# EAGLE design decoder (EAGLE 9.6.2)
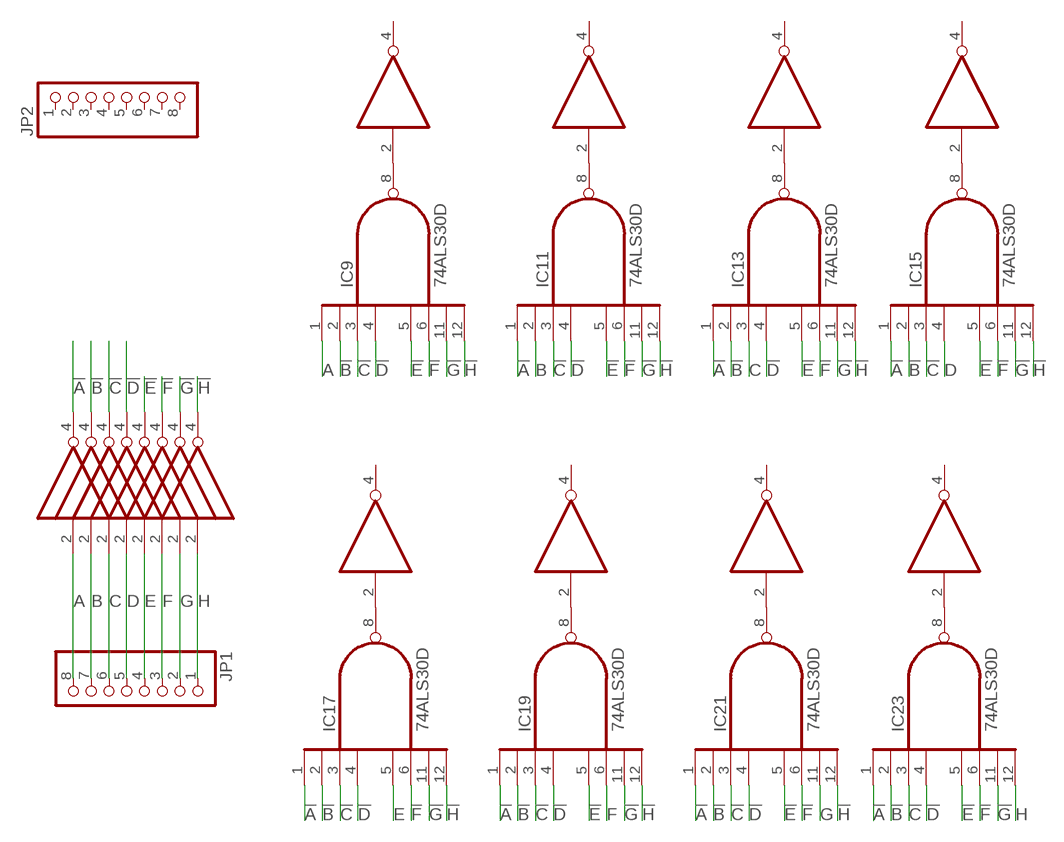
[diagram p0: schematic, sheet 1]

## Parts
IC1  74AUC1G04DBV  [SOT23-5]
IC2  74AUC1G04DBV  [SOT23-5]
IC3  74AUC1G04DBV  [SOT23-5]
IC4  74AUC1G04DBV  [SOT23-5]
IC5  74AUC1G04DBV  [SOT23-5]
IC6  74AUC1G04DBV  [SOT23-5]
IC7  74AUC1G04DBV  [SOT23-5]
IC8  74AUC1G04DBV  [SOT23-5]
IC9  74ALS30D  [SO14]
IC10  74AUC1G04DBV  [SOT23-5]
IC11  74ALS30D  [SO14]
IC12  74AUC1G04DBV  [SOT23-5]
IC13  74ALS30D  [SO14]
IC14  74AUC1G04DBV  [SOT23-5]
IC15  74ALS30D  [SO14]
IC16  74AUC1G04DBV  [SOT23-5]
IC17  74ALS30D  [SO14]
IC18  74AUC1G04DBV  [SOT23-5]
IC19  74ALS30D  [SO14]
IC20  74AUC1G04DBV  [SOT23-5]
IC21  74ALS30D  [SO14]
IC22  74AUC1G04DBV  [SOT23-5]
IC23  74ALS30D  [SO14]
IC24  74AUC1G04DBV  [SOT23-5]
JP1  PINHD-1X8  [1X08]
JP2  PINHD-1X8  [1X08]

## Nets
!A: IC1.4(O) IC11.1(I0) IC13.1(I0) IC15.1(I0) IC17.1(I0) IC19.1(I0) IC21.1(I0) IC23.1(I0)
!B: IC2.4(O) IC9.2(I1) IC13.2(I1) IC15.2(I1) IC17.2(I1) IC19.2(I1) IC21.2(I1) IC23.2(I1)
!C: IC3.4(O) IC9.3(I2) IC11.3(I2) IC15.3(I2) IC17.3(I2) IC19.3(I2) IC21.3(I2) IC23.3(I2)
!D: IC4.4(O) IC9.4(I3) IC11.4(I3) IC13.4(I3) IC17.4(I3) IC19.4(I3) IC21.4(I3) IC23.4(I3)
!E: IC5.4(O) IC9.5(I4) IC11.5(I4) IC13.5(I4) IC15.5(I4) IC19.5(I4) IC21.5(I4) IC23.5(I4)
!F: IC6.4(O) IC9.6(I5) IC11.6(I5) IC13.6(I5) IC15.6(I5) IC17.6(I5) IC21.6(I5) IC23.6(I5)
!G: IC7.4(O) IC9.11(I6) IC11.11(I6) IC13.11(I6) IC15.11(I6) IC17.11(I6) IC19.11(I6) IC23.11(I6)
!H: IC8.4(O) IC9.12(I7) IC11.12(I7) IC13.12(I7) IC15.12(I7) IC17.12(I7) IC19.12(I7) IC21.12(I7)
A: IC1.2(I) IC9.1(I0) JP1.8
B: IC2.2(I) IC11.2(I1) JP1.7
C: IC3.2(I) IC13.3(I2) JP1.6
D: IC4.2(I) IC15.4(I3) JP1.5
E: IC5.2(I) IC17.5(I4) JP1.4
F: IC6.2(I) IC19.6(I5) JP1.3
G: IC7.2(I) IC21.11(I6) JP1.2
H: IC8.2(I) IC23.12(I7) JP1.1
N$1: IC9.8(O) IC10.2(I)
N$2: IC11.8(O) IC12.2(I)
N$3: IC13.8(O) IC14.2(I)
N$4: IC15.8(O) IC16.2(I)
N$5: IC17.8(O) IC18.2(I)
N$6: IC19.8(O) IC20.2(I)
N$7: IC21.8(O) IC22.2(I)
N$8: IC23.8(O) IC24.2(I)
Unconnected: IC10.4(O) IC12.4(O) IC14.4(O) IC16.4(O) IC18.4(O) IC20.4(O) IC22.4(O) IC24.4(O) JP2.1 JP2.2 JP2.3 JP2.4 JP2.5 JP2.6 JP2.7 JP2.8

## Power pins joined to a net without a drawn wire
GND: IC1.3(GND) IC2.3(GND) IC3.3(GND) IC4.3(GND) IC5.3(GND) IC6.3(GND) IC7.3(GND) IC8.3(GND) IC9.7(GND) IC10.3(GND) IC11.7(GND) IC12.3(GND) IC13.7(GND) IC14.3(GND) IC15.7(GND) IC16.3(GND) IC17.7(GND) IC18.3(GND) IC19.7(GND) IC20.3(GND) IC21.7(GND) IC22.3(GND) IC23.7(GND) IC24.3(GND)
VCC: IC1.5(VCC) IC2.5(VCC) IC3.5(VCC) IC4.5(VCC) IC5.5(VCC) IC6.5(VCC) IC7.5(VCC) IC8.5(VCC) IC9.14(VCC) IC10.5(VCC) IC11.14(VCC) IC12.5(VCC) IC13.14(VCC) IC14.5(VCC) IC15.14(VCC) IC16.5(VCC) IC17.14(VCC) IC18.5(VCC) IC19.14(VCC) IC20.5(VCC) IC21.14(VCC) IC22.5(VCC) IC23.14(VCC) IC24.5(VCC)

## Library data of the parts
IC1-IC8 IC10 IC12 IC14 IC16 IC18 IC20 IC22 IC24 = 74xx-little-us:74*1G04: INVERTER Gate
IC9 IC11 IC13 IC15 IC17 IC19 IC21 IC23 = 74xx-us:74*30: 8-input NAND gate
JP1 JP2 = pinhead:PINHD-1X8: PIN HEADER

## Board
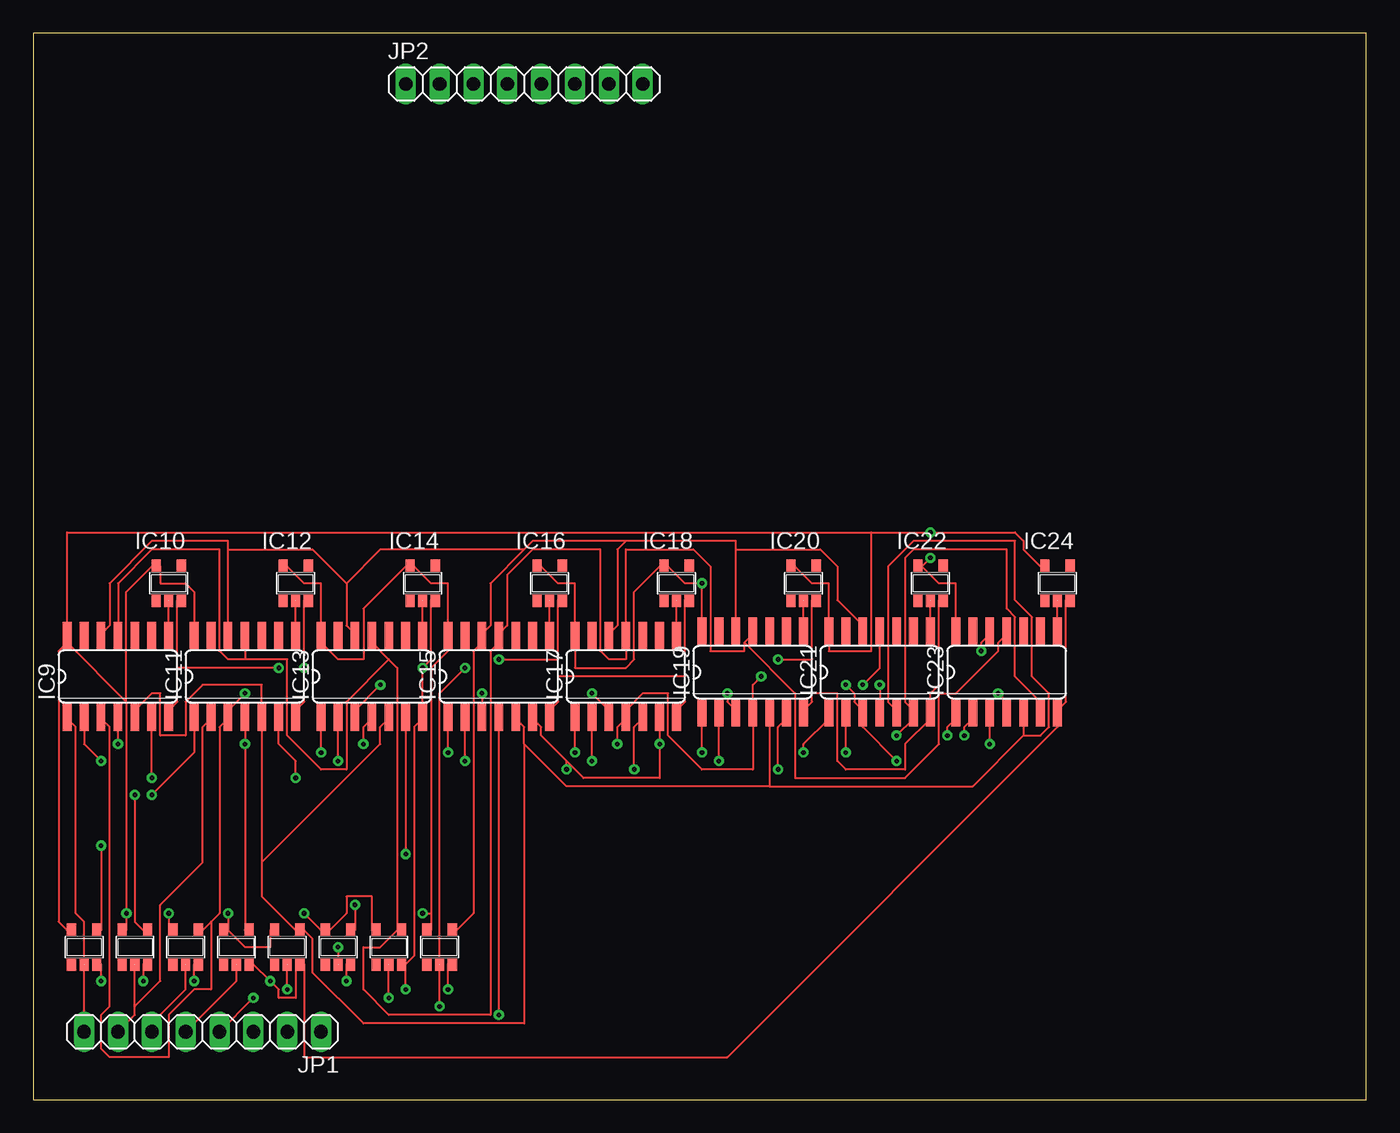
[diagram p1: board, top side]
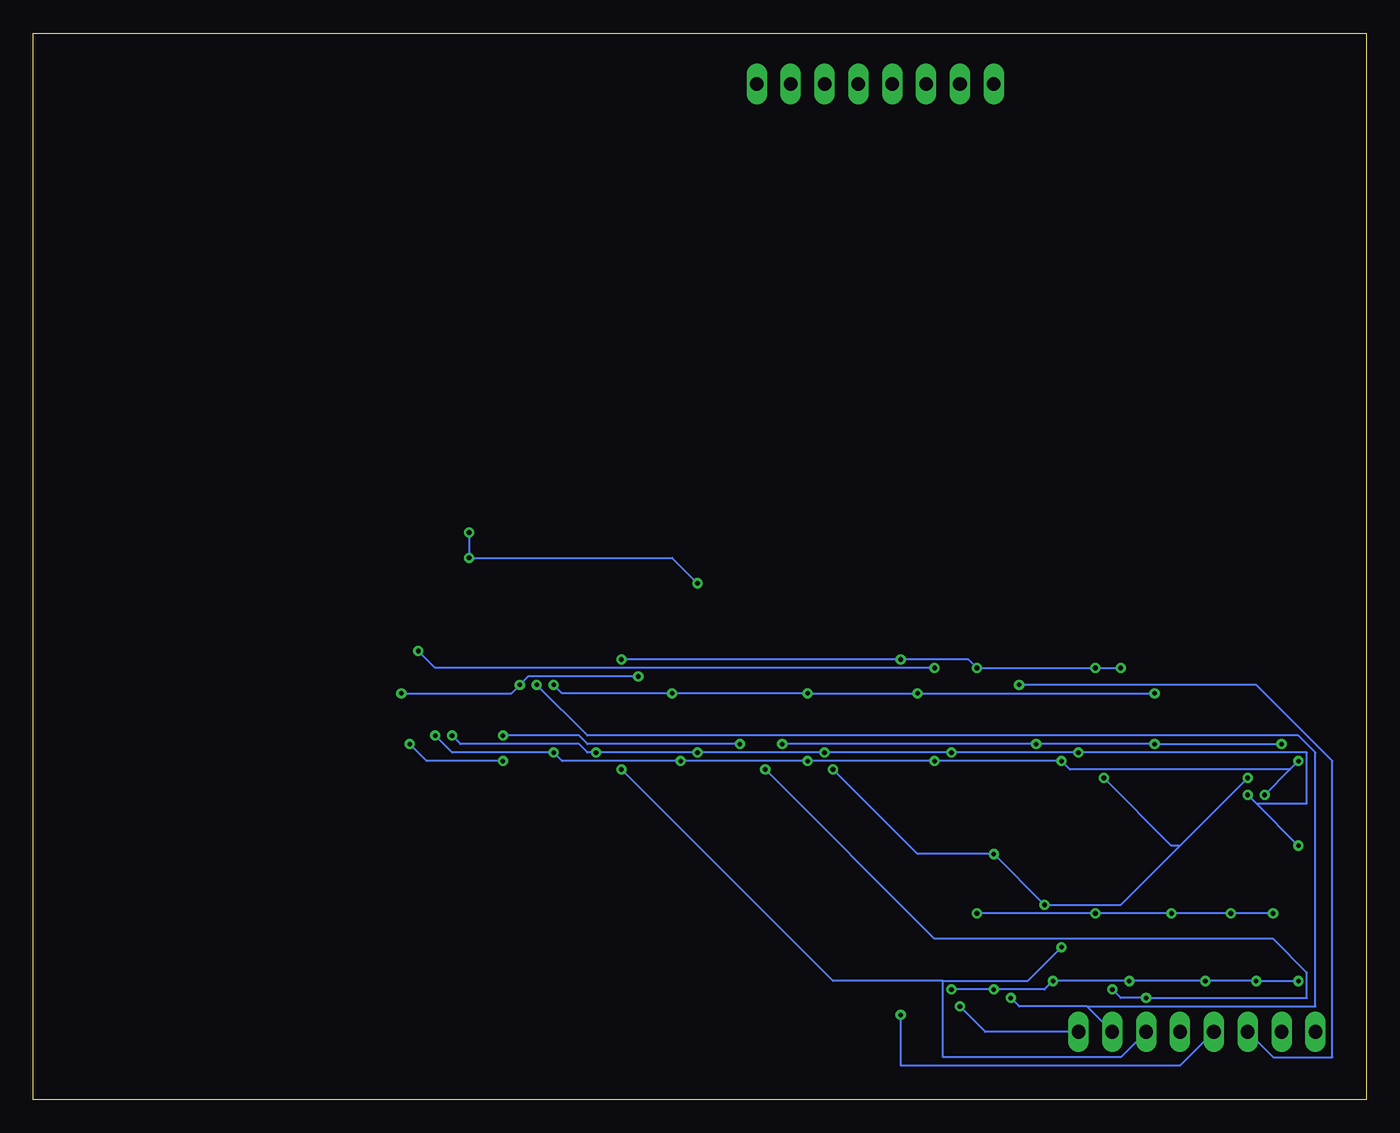
[diagram p2: board, bottom side, seen from below]

Size 100 x 80 mm. Coordinates in mm from the lower left corner, seen from the top.
Outline: 0,0 100,0 100,80 0,80 0,0
Copper layers (1*16): Top 0.035mm / dielectric 1.5mm / Bottom 0.035mm
Design rules "default": minimum track width 6mil, minimum drill 0.35mm, track to track 6mil, track to pad 6mil, pad to pad 6mil, via to via 6mil, smd to smd 6mil, copper to edge 40mil, drill to drill 6mil, minimum pad ring 10mil, minimum via ring 8mil, stop-mask expansion 4mil, vias tented up to drill 0mil, thermal gap 10mil

### Footprints (pad centres in the part's own frame; a part is rotated, then mirrored left to right if it is on the bottom)
SOT23-5 = smd 0.69 x 0.99: 1 -0.95,-1.29; 2 0,-1.29; 3 0.95,-1.29; 4 0.95,1.3; 5 -0.95,1.3
SO14 = smd 0.66 x 2.032: 1 -3.81,-3.073; 2 -2.54,-3.073; 3 -1.27,-3.073; 4 0,-3.073; 5 1.27,-3.073; 6 2.54,-3.073; 7 3.81,-3.073; 8 3.81,3.073; 9 2.54,3.073; 10 1.27,3.073; 11 0,3.073; 12 -1.27,3.073; 13 -2.54,3.073; 14 -3.81,3.073
1X08 = drill 1.016 long: 1 -8.89,0; 2 -6.35,0; 3 -3.81,0; 4 -1.27,0; 5 1.27,0; 6 3.81,0; 7 6.35,0; 8 8.89,0

### Placement (x,y rotation side)
IC1  3.81,11.43 0 top
IC2  7.62,11.43 0 top
IC3  11.43,11.43 0 top
IC4  15.24,11.43 0 top
IC5  19.05,11.43 0 top
IC6  22.86,11.43 0 top
IC7  26.67,11.43 0 top
IC8  30.48,11.43 0 top
IC9  6.35,31.75 0 top
IC10  10.16,38.73 0 top
IC11  15.88,31.75 0 top
IC12  19.68,38.73 0 top
IC13  25.4,31.75 0 top
IC14  29.21,38.73 0 top
IC15  34.92,31.75 0 top
IC16  38.73,38.73 0 top
IC17  44.45,31.75 0 top
IC18  48.26,38.73 0 top
IC19  53.98,32.07 0 top
IC20  57.78,38.73 0 top
IC21  63.5,32.07 0 top
IC22  67.31,38.73 0 top
IC23  73.03,32.07 0 top
IC24  76.83,38.73 0 top
JP1  12.7,5.08 180 top
JP2  36.83,76.2 0 top

### Tracks (layer width: path | path; a pad name or v marks a point on that pad's centre or on a via)
!A  (via drill 0.35)
  Top 0.152: v5.08,19.05 5.08,12.7 IC1.4 | v8.89,22.86 12.06,26.04 IC11.1 | v21.59,26.04 IC13.1 | v31.11,26.04 IC15.1 | v40.64,26.04 IC17.1 | v50.16,26.04 IC19.1 | v57.78,26.04 57.78,26.67 59.69,28.57 IC21.1 | v68.58,27.3 68.58,27.94 69.22,28.57 IC23.1
  Bottom 0.152: v8.89,22.86 8.26,22.23 | 8.26,22.23 v5.08,19.05 | 8.26,22.23 4.45,22.23 4.45,26.04 v21.59,26.04 v31.11,26.04 v40.64,26.04 v50.16,26.04 v57.78,26.04 58.42,26.04 59.05,26.67 67.94,26.67 v68.58,27.3
!B  (via drill 0.35)
  Top 0.152: v7.62,22.86 7.62,13.34 8.26,12.7 IC2.4 | v5.08,25.4 3.81,26.67 IC9.2 | v22.86,25.4 IC13.2 | v32.38,25.4 IC15.2 | v41.91,25.4 IC17.2 | v51.44,25.4 IC19.2 | v60.96,26.04 IC21.2 | v69.85,27.3 69.85,27.94 70.48,28.57 IC23.2
  Bottom 0.152: v5.08,25.4 5.71,24.77 | 5.71,24.77 v7.62,22.86 | 5.71,24.77 22.23,24.77 v22.86,25.4 v32.38,25.4 v41.91,25.4 v51.44,25.4 60.33,25.4 v60.96,26.04 68.58,26.04 v69.85,27.3
!C  (via drill 0.35)
  Top 0.152: 13.34,13.34 13.97,13.97 13.97,27.94 14.61,28.57 IC11.3 14.61,29.21 v15.88,30.48 | 13.34,13.34 12.7,12.7 IC3.4 | 13.34,13.34 13.34,8.26 12.06,8.26 10.16,6.35 10.16,3.17 5.71,3.17 5.08,3.81 5.08,6.35 5.71,6.99 5.71,27.94 5.08,28.57 IC9.3 | v33.66,30.48 IC15.3 | v41.91,30.48 43.18,29.21 IC17.3 | v52.07,30.48 52.07,29.84 52.7,29.21 IC19.3 | v60.96,31.11 61.59,30.48 61.59,29.84 62.23,29.21 IC21.3 62.23,27.94 v64.77,25.4 | v71.75,26.67 IC23.3
  Bottom 0.152: v60.96,31.11 60.33,30.48 v52.07,30.48 v41.91,30.48 v33.66,30.48 v15.88,30.48 | v71.75,26.67 70.48,25.4 v64.77,25.4
!D  (via drill 0.35)
  Top 0.152: v63.5,31.11 IC21.4 | v72.39,30.48 73.03,29.84 IC23.4 | v54.61,31.75 53.98,31.11 IC19.4 53.98,24.77 50.16,24.77 47.62,27.3 47.62,30.48 45.72,30.48 44.45,29.21 IC17.4 44.45,28.57 43.81,27.94 v43.81,26.67 | IC11.4 v15.88,26.67 15.88,12.7 IC4.4 | v6.35,26.67 IC9.4 | v24.77,26.67 24.77,27.94 25.4,28.57 IC13.4
  Bottom 0.152: v72.39,30.48 64.14,30.48 v63.5,31.11 62.87,31.75 v54.61,31.75 | v6.35,26.67 v15.88,26.67 v24.77,26.67 v43.81,26.67
!E
  Top 0.152: 17.14,17.78 IC11.5 17.14,31.11 12.7,31.11 11.43,29.84 11.43,27.3 9.53,27.3 9.53,30.48 8.89,30.48 7.62,29.21 IC9.5 | 17.14,17.78 17.14,15.24 19.68,12.7 IC5.4 20.32,12.7 20.95,12.06 20.95,9.53 24.77,5.71 36.83,5.71 36.83,26.67 | 17.14,17.78 26.04,26.67 26.04,27.94 26.67,28.57 IC13.5 | 74.3,27.3 75.56,27.3 76.2,27.94 76.2,30.48 74.93,31.75 74.93,36.2 73.66,37.47 73.66,41.91 66.04,41.91 64.14,40.01 64.14,29.84 64.77,29.21 IC21.5 | IC23.5 74.3,27.3 | 36.83,26.67 36.83,27.94 36.2,28.57 IC15.5 | 36.83,26.67 40.01,23.5 55.24,23.5 | IC19.5 55.24,23.5 | 74.3,27.3 70.48,23.5 55.24,23.5
!F  (via drill 0.35)
  Top 0.152: IC23.6 75.56,29.84 73.66,31.75 73.66,36.2 73.03,36.83 73.03,41.27 66.04,41.27 65.41,40.64 65.41,29.84 66.04,29.21 IC21.6 66.04,28.57 v64.77,27.3 | 40.01,25.4 41.27,24.13 46.99,24.13 v46.99,26.67 IC17.6 | 40.01,25.4 38.1,27.3 38.1,27.94 37.47,28.57 IC15.6 | v24.13,14.61 24.13,12.7 IC6.4 | IC13.6 v27.94,18.41 | v8.89,24.13 IC9.6 | IC11.6 18.41,26.67 19.68,25.4 v19.68,24.13 | v40.01,24.77 40.01,25.4
  Bottom 0.152: 13.97,19.05 18.41,14.61 v24.13,14.61 v27.94,18.41 33.66,18.41 v40.01,24.77 | 13.97,19.05 v8.89,24.13 | v19.68,24.13 14.61,19.05 13.97,19.05 | v64.77,27.3 59.05,27.3 58.42,26.67 v46.99,26.67
!G
  Top 0.152: IC9.11 6.35,38.73 8.89,41.27 13.97,41.27 13.97,33.66 14.61,33.02 15.88,33.02 | IC11.11 15.88,33.02 | 27.3,12.7 27.3,32.38 26.67,33.02 | 26.67,33.02 25.4,34.29 IC13.11 | 15.88,33.02 19.05,33.02 19.05,27.3 21.59,24.77 23.5,24.77 23.5,29.84 26.67,33.02 | 53.34,34.29 53.98,34.92 IC19.11 | 53.34,34.29 53.34,33.66 50.8,33.66 50.8,40.01 49.53,41.27 44.45,41.27 IC17.11 44.45,33.02 43.18,33.02 42.55,33.66 42.55,41.27 37.47,41.27 35.56,39.37 35.56,35.56 34.92,34.92 IC15.11 34.92,34.29 34.29,33.66 34.29,6.35 26.67,6.35 24.77,8.26 24.77,11.43 26.04,11.43 27.3,12.7 | 53.34,34.29 57.15,30.48 57.15,24.13 65.41,24.13 67.94,26.67 67.94,30.48 69.22,30.48 72.39,33.66 72.39,34.29 73.03,34.92 IC23.11 | 27.3,12.7 IC7.4
!H
  Top 0.152: IC11.12 14.61,41.27 | 14.61,41.27 14.61,41.91 8.89,41.91 5.71,38.73 5.71,35.56 5.08,34.92 IC9.12 | 23.5,38.73 23.5,35.56 24.13,34.92 IC13.12 | 23.5,38.73 20.95,41.27 14.61,41.27 | IC8.4 31.75,12.7 33.02,13.97 33.02,33.66 33.66,34.29 IC15.12 33.66,34.92 34.29,35.56 34.29,38.73 36.83,41.27 | 44.45,41.91 43.81,41.27 43.81,35.56 43.18,34.92 IC17.12 | 44.45,41.91 52.7,41.91 52.7,41.27 | IC19.12 52.7,41.27 | 52.7,41.27 59.05,41.27 60.33,40.01 60.33,37.47 62.23,35.56 IC21.12 | 36.83,41.27 37.47,41.91 44.45,41.91 | 23.5,38.73 26.04,41.27 36.83,41.27
A
  Top 0.152: JP1.8 IC1.2 3.81,10.16 3.81,13.34 3.17,13.97 3.17,27.94 2.54,28.57 IC9.1
B
  Top 0.152: 7.62,6.99 7.62,6.35 JP1.7 | 7.62,6.99 IC2.2 7.62,10.16 | 7.62,6.99 9.53,8.89 9.53,14.61 12.7,17.78 12.7,27.94 13.34,28.57 IC11.2
C  (via drill 0.35)
  Top 0.152: JP1.6 8.89,5.71 11.43,8.26 IC3.2 11.43,10.16 | v26.04,31.11 24.13,29.21 IC13.3
  Bottom 0.152: v26.04,31.11 8.26,31.11 2.54,25.4 2.54,3.17 6.99,3.17 JP1.6
D  (via drill 0.35)
  Top 0.152: JP1.5 15.24,8.89 IC4.2 15.24,10.16 | v34.92,6.35 IC15.4
  Bottom 0.152: v34.92,6.35 34.92,2.54 13.97,2.54 JP1.5
E  (via drill 0.35)
  Top 0.152: v19.05,8.26 IC5.2 19.05,10.16 | JP1.4 v16.51,7.62 | v45.09,24.77 45.09,27.94 45.72,28.57 IC17.5
  Bottom 0.152: v19.05,8.26 18.41,7.62 v16.51,7.62 4.45,7.62 4.45,9.53 6.99,12.06 32.38,12.06 v45.09,24.77
F  (via drill 0.35)
  Top 0.152: v22.86,11.43 IC6.2 | v55.88,24.77 55.88,27.94 56.52,28.57 IC19.6
  Bottom 0.152: v22.86,11.43 25.4,8.89 31.75,8.89 | 31.75,8.89 31.75,3.17 18.41,3.17 JP1.3 | v55.88,24.77 40.01,8.89 31.75,8.89
G  (via drill 0.35)
  Top 0.152: v26.67,7.62 IC7.2 26.67,10.16 | IC21.11 63.5,32.38 v62.23,31.11
  Bottom 0.152: v26.67,7.62 26.04,6.99 20.95,6.99 | JP1.2 20.95,6.99 | v62.23,31.11 58.42,27.3 5.08,27.3 3.81,26.04 3.81,6.99 20.95,6.99
GND  (via drill 0.35)
  Top 0.152: 58.42,30.48 58.42,29.84 57.78,29.21 IC19.7 | 58.42,30.48 58.42,33.02 | 58.42,33.02 58.42,37.47 IC20.3 | IC22.3 67.94,37.47 67.94,31.11 67.31,30.48 IC21.7 67.31,28.57 65.41,26.67 65.41,24.77 60.96,24.77 60.33,25.4 60.33,30.48 58.42,30.48 | 39.37,31.75 39.37,29.84 38.73,29.21 IC15.7 | 39.37,31.75 39.37,33.02 | 39.37,33.02 39.37,37.47 IC16.3 | 48.9,31.75 48.9,29.84 48.26,29.21 IC17.7 | 48.9,31.75 48.9,37.47 IC18.3 | 48.9,31.75 39.37,31.75 | 10.79,32.38 10.79,29.84 10.16,29.21 IC9.7 | 10.79,32.38 10.79,37.47 IC10.3 | IC12.3 20.32,37.47 v20.32,32.38 20.32,29.84 19.68,29.21 IC11.7 | v18.41,32.38 10.79,32.38 | 27.94,10.16 28.57,10.79 28.57,27.94 29.21,28.57 IC13.7 v29.21,32.38 29.84,33.02 29.84,37.47 IC14.3 | v34.92,33.02 39.37,33.02 | v55.88,33.02 58.42,33.02 | IC24.3 77.47,37.47 77.47,29.84 76.83,29.21 IC23.7 76.83,27.94 52.07,3.17 20.32,3.17 20.32,10.16 IC5.3 19.68,10.16 19.68,7.62 18.41,7.62 18.41,8.26 v17.78,8.89 16.51,10.16 IC4.3 | v5.08,8.89 5.08,10.16 IC1.3 | v8.26,8.89 8.26,10.16 IC2.3 | v12.06,8.89 12.06,10.16 IC3.3 | v23.5,8.89 23.5,10.16 IC6.3 | v31.11,8.26 31.11,10.16 IC8.3 | v27.94,8.26 27.94,10.16 | 27.94,10.16 IC7.3
  Bottom 0.152: v18.41,32.38 v20.32,32.38 v29.21,32.38 29.84,33.02 v34.92,33.02 v55.88,33.02 | v5.08,8.89 v8.26,8.89 v12.06,8.89 v17.78,8.89 v23.5,8.89 24.13,8.26 v27.94,8.26 v31.11,8.26
H  (via drill 0.35)
  Top 0.152: v30.48,6.99 IC8.2 30.48,10.16 30.48,30.48 v32.38,32.38 | v71.12,33.66 71.12,34.29 71.75,34.92 IC23.12
  Bottom 0.152: v30.48,6.99 28.57,5.08 JP1.1 | v71.12,33.66 69.85,32.38 v32.38,32.38
N$1
  Top 0.152: IC9.8 IC10.2 10.16,37.47
N$2
  Top 0.152: IC11.8 IC12.2 19.68,37.47
N$3
  Top 0.152: IC13.8 IC14.2 29.21,37.47
N$4
  Top 0.152: IC15.8 IC16.2 38.73,37.47
N$5
  Top 0.152: IC17.8 IC18.2 48.26,37.47
N$6
  Top 0.152: IC19.8 IC20.2 57.78,37.47
N$7
  Top 0.152: IC21.8 IC22.2 67.31,37.47
N$8
  Top 0.152: IC23.8 IC24.2 76.83,37.47
VCC  (via drill 0.35)
  Top 0.152: IC19.14 v50.16,38.73 48.9,38.73 47.62,40.01 IC18.5 46.99,40.01 45.09,38.1 45.09,33.02 44.45,32.38 40.64,32.38 IC17.14 40.64,38.73 39.37,38.73 38.1,40.01 IC16.5 | 66.67,40.01 67.94,38.73 69.22,38.73 IC23.14 | IC20.5 57.15,40.01 58.42,38.73 59.69,38.73 IC21.14 59.69,33.66 62.87,33.66 62.87,42.55 | 62.87,42.55 v67.31,42.55 73.66,42.55 74.3,41.91 74.3,41.27 75.56,40.01 IC24.5 | v67.31,40.64 66.67,40.01 | 66.67,40.01 IC22.5 | IC12.5 19.05,40.01 20.32,38.73 21.59,38.73 IC13.14 21.59,34.29 22.86,33.02 24.77,33.02 24.77,36.83 27.94,40.01 IC14.5 28.57,40.01 29.84,38.73 31.11,38.73 IC15.14 31.11,33.66 29.84,32.38 29.84,13.97 | 29.84,13.97 29.84,12.7 IC8.5 | IC7.5 25.4,12.7 25.4,15.24 23.5,15.24 23.5,13.97 22.23,12.7 IC6.5 21.59,12.7 v20.32,13.97 | 14.61,12.7 15.88,11.43 17.78,11.43 17.78,12.7 IC5.5 | 2.54,34.29 1.91,33.66 1.91,13.34 2.54,12.7 IC1.5 | 6.99,29.84 v6.99,13.97 6.99,12.7 IC2.5 | 2.54,34.29 6.99,29.84 | 2.54,34.29 IC9.14 2.54,42.55 62.87,42.55 | v10.16,13.97 10.16,12.7 IC3.5 | 6.99,29.84 6.99,38.1 8.89,40.01 IC10.5 9.53,40.01 9.53,38.73 11.43,38.73 12.06,38.1 IC11.14 | v14.61,13.97 14.61,12.7 | 14.61,12.7 IC4.5 | v29.21,13.97 29.84,13.97
  Bottom 0.152: v67.31,42.55 v67.31,40.64 52.07,40.64 v50.16,38.73 | v6.99,13.97 v10.16,13.97 v14.61,13.97 v20.32,13.97 v29.21,13.97